# EAGLE design usbcpd (EAGLE 9.2.2)
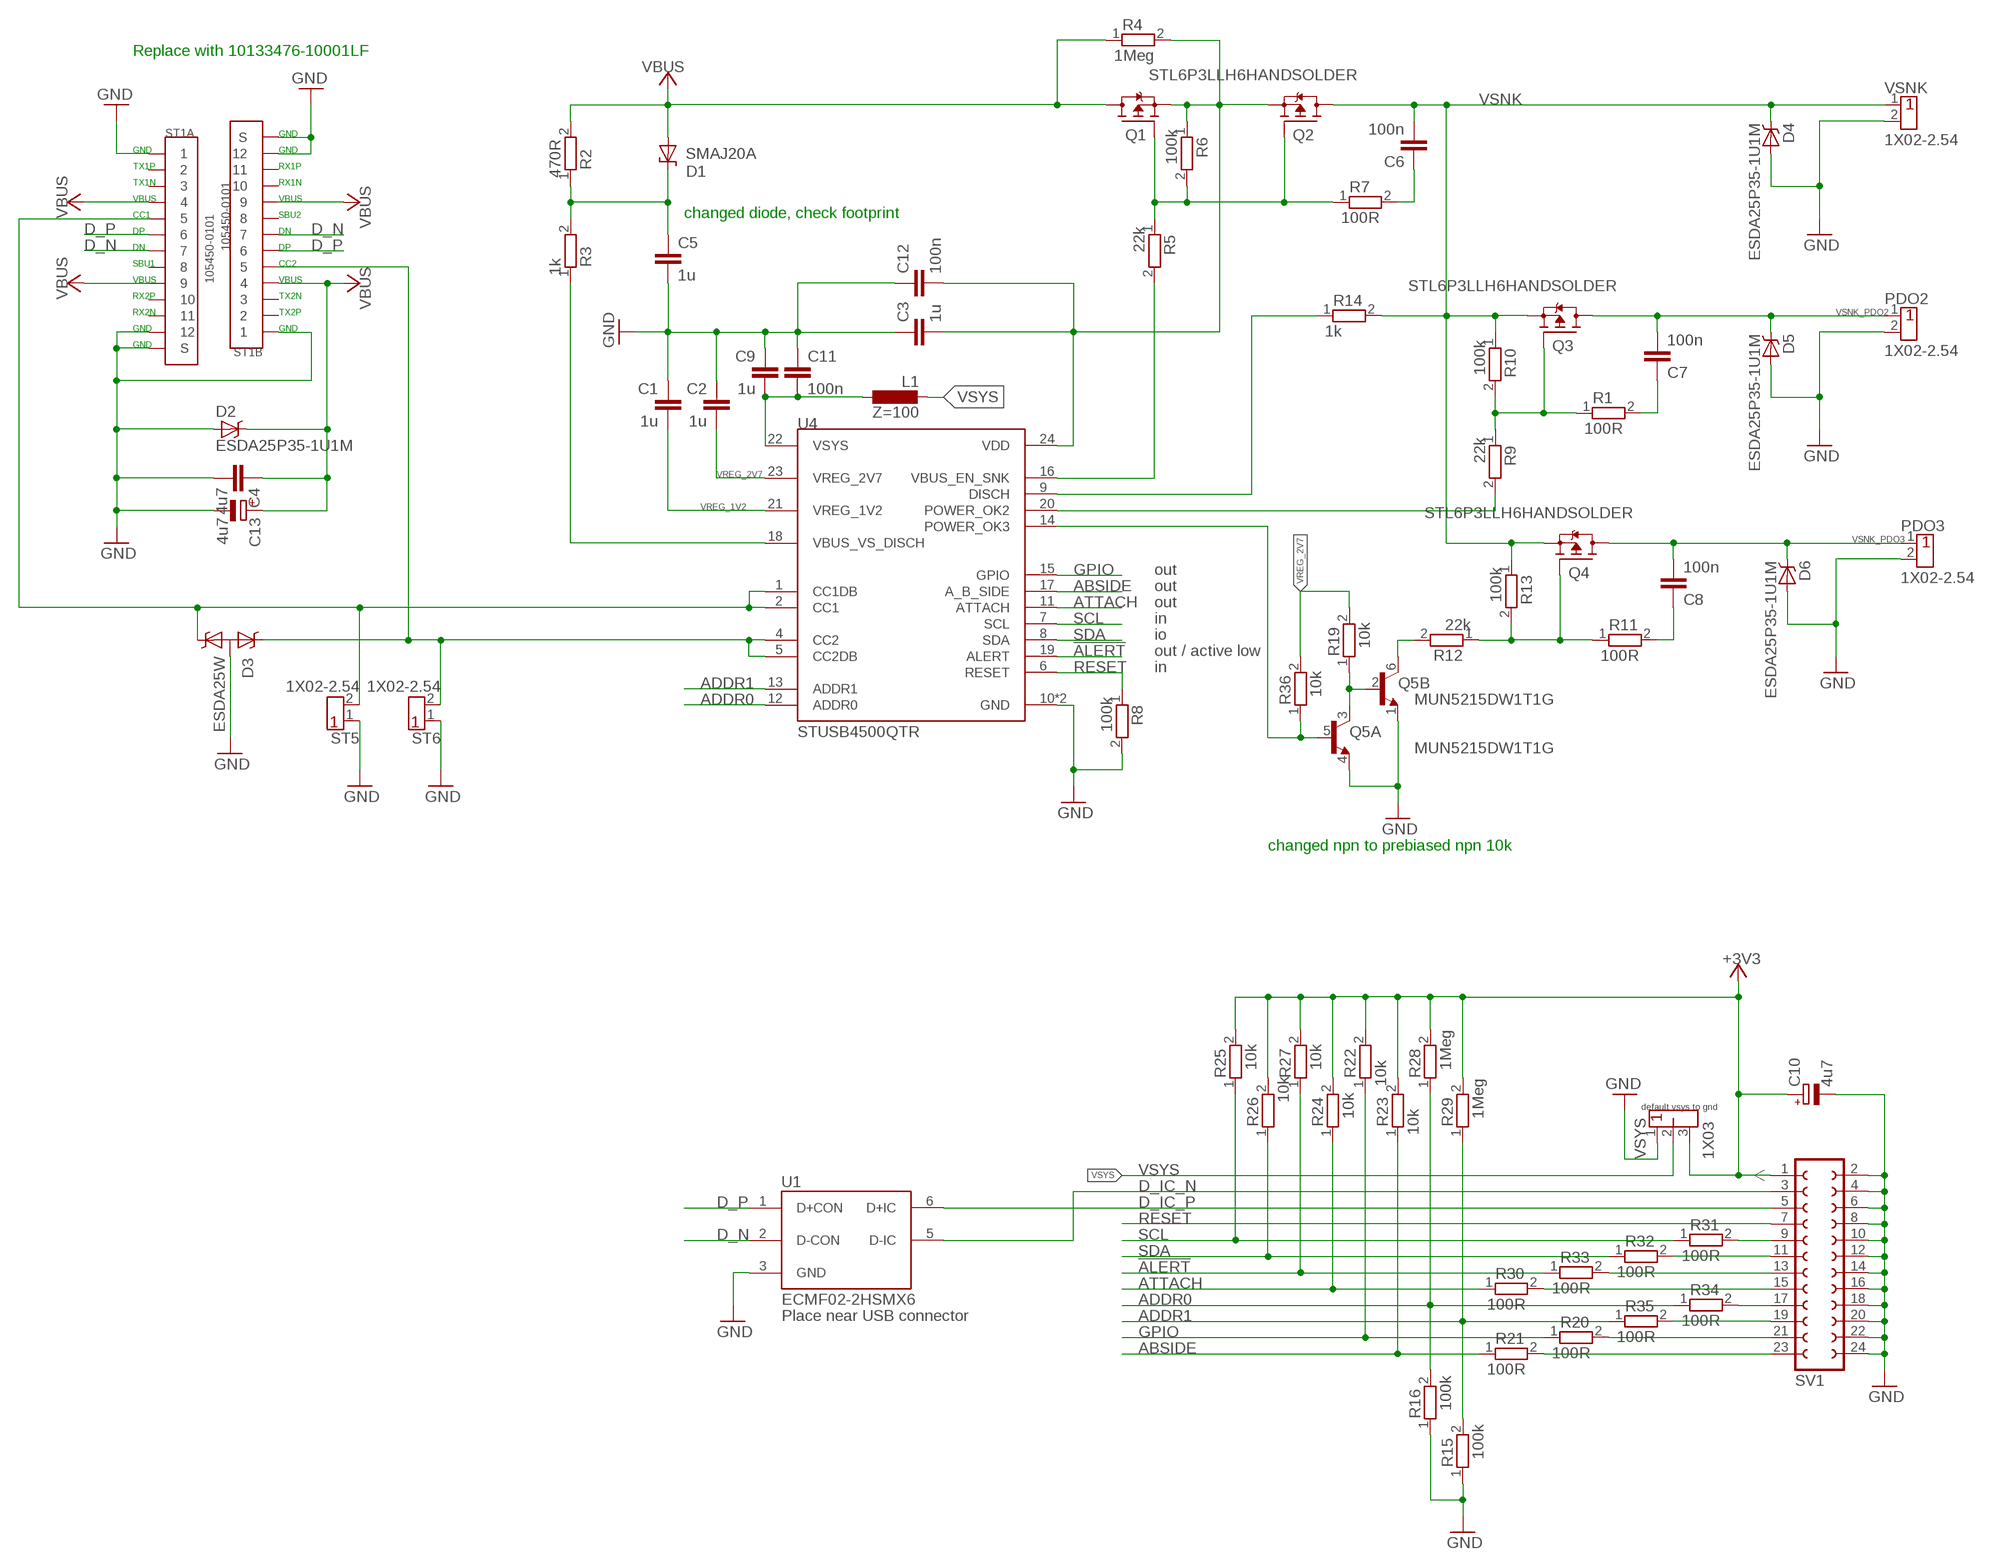
[diagram p0: schematic, sheet 1]

## Parts
C1  1u  C-EU0805  [0805]
C2  1u  C-EU0805  [0805]
C3  1u  C-EU0805  [0805]
C4  4u7  C-EU0805  [0805]
C5  1u  C-EU0805  [0805]
C6  100n  C-EU0805  [0805]
C7  100n  C-EU0805  [0805]
C8  100n  C-EU0805  [0805]
C9  1u  C-EU0805  [0805]
C10  4u7  CPOL-EUE2-5  [E2-5]
C11  100n  C-EU0805  [0805]
C12  100n  C-EU0805  [0805]
C13  4u7  CPOL-EUE2-5  [E2-5]
D1  SMAJ20A  SMBJ28A  [SMBJ]
D2  ESDA25P35-1U1M  [QFN1610]
D3  ESDA25W  [SOT323-3]
D4  ESDA25P35-1U1M  [QFN1610]
D5  ESDA25P35-1U1M  [QFN1610]
D6  ESDA25P35-1U1M  [QFN1610]
L1  Z=100  L-EU0805  [0805]
PDO2  1X02-2.54  [1X02-2.54]
PDO3  1X02-2.54  [1X02-2.54]
Q1  STL6P3LLH6HANDSOLDER  [POWERFLAT-TYPEC-HANDSOLDER]
Q2  STL6P3LLH6HANDSOLDER  [POWERFLAT-TYPEC-HANDSOLDER]
Q3  STL6P3LLH6HANDSOLDER  [POWERFLAT-TYPEC-HANDSOLDER]
Q4  STL6P3LLH6HANDSOLDER  [POWERFLAT-TYPEC-HANDSOLDER]
Q5  MUN5215DW1T1G  BC847CDW1  [SOT363]
R1  100R  R-EU0805  [0805]
R2  470R  R-EU0805  [0805]
R3  1k  R-EU0805  [0805]
R4  1Meg  R-EU0805  [0805]
R5  22k  R-EU0805  [0805]
R6  100k  R-EU0805  [0805]
R7  100R  R-EU0805  [0805]
R8  100k  R-EU0805  [0805]
R9  22k  R-EU0805  [0805]
R10  100k  R-EU0805  [0805]
R11  100R  R-EU0805  [0805]
R12  22k  R-EU0805  [0805]
R13  100k  R-EU0805  [0805]
R14  1k  R-EU0805  [0805]
R15  100k  R-EU0805  [0805]
R16  100k  R-EU0805  [0805]
R19  10k  R-EU0805  [0805]
R20  100R  R-EU0805  [0805]
R21  100R  R-EU0805  [0805]
R22  10k  R-EU0805  [0805]
R23  10k  R-EU0805  [0805]
R24  10k  R-EU0805  [0805]
R25  10k  R-EU0805  [0805]
R26  10k  R-EU0805  [0805]
R27  10k  R-EU0805  [0805]
R28  1Meg  R-EU0805  [0805]
R29  1Meg  R-EU0805  [0805]
R30  100R  R-EU0805  [0805]
R31  100R  R-EU0805  [0805]
R32  100R  R-EU0805  [0805]
R33  100R  R-EU0805  [0805]
R34  100R  R-EU0805  [0805]
R35  100R  R-EU0805  [0805]
R36  10k  R-EU0805  [0805]
ST1  105450-0101  [105450-0101]
ST5  1X02-2.54  [1X02-2.54]
ST6  1X02-2.54  [1X02-2.54]
SV1  FE12-2  [FE12-2]
U1  ECMF02-2HSMX6  [UQFN6]
U4  STUSB4500QTR  [QFN24EP]
VSNK  1X02-2.54  [1X02-2.54]
VSYS  1X03  [1X03-2.54]

## Nets
!ALERT: R27.1 R33.1 U4.19(ALERT)
+3V3: C10.+ R22.2 R23.2 R24.2 R25.2 R26.2 R27.2 R28.2 R29.2 SV1.1 VSYS.3
ABSIDE: R21.1 R23.1 U4.17(A_B_SIDE)
ADDR0: R16.2 R28.1 R34.1 U4.12(ADDR0)
ADDR1: R15.2 R29.1 R35.1 U4.13(ADDR1)
ATTACH: R24.1 R30.1 U4.11(ATTACH)
CC1: D3.2(C2) ST1.A5 ST5.2 U4.1(CC1DB) U4.2(CC1)
CC2: D3.1(C1) ST1.B5 ST6.2 U4.4(CC2) U4.5(CC2DB)
D_IC_N [lvds]: SV1.3 U1.5(D-IC)
D_IC_P [lvds]: SV1.5 U1.6(D+IC)
D_N [lvds]: ST1.A7 ST1.B7 U1.2(D-CON)
D_P [lvds]: ST1.A6 ST1.B6 U1.1(D+CON)
DISCH: R14.1 U4.9(DISCH)
GND: C1.1 C2.1 C3.1 C4.2 C5.2 C9.1 C10.- C11.1 C12.1 C13.- D2.2(A) D3.3(A) D4.2(A) D5.2(A) D6.2(A) PDO2.2 PDO3.2 Q5.1(B:E) Q5.4(A:E) R8.2 R15.1 R16.1 ST1.A1 ST1.A12 ST1.B1 ST1.B12 ST1.G1(A:S) ST1.G2(A:S) ST1.G3(A:S) ST1.G4(A:S) ST1.G5(B:S) ST1.G6(B:S) ST1.G7(A:S) ST1.G8(B:S) ST1.G9(A:S) ST1.G10(A:S) ST1.G11(A:S) ST1.G12(A:S) ST1.G13(A:S) ST1.G14(A:S) ST1.G15(A:S) ST1.G16(A:S) ST1.G17(A:S) ST1.G18(A:S) ST1.G19(A:S) ST1.G20(B:S) ST1.G21(B:S) ST1.G22(B:S) ST1.G23(B:S) ST1.G24(B:S) ST1.G25(B:S) ST1.G26(B:S) ST1.G27(B:S) ST1.G28(B:S) ST1.G29(B:S) ST1.G30(B:S) ST1.G31(B:S) ST1.G32(B:S) ST1.G33(B:S) ST5.1 ST6.1 SV1.2 SV1.4 SV1.6 SV1.8 SV1.10 SV1.12 SV1.14 SV1.16 SV1.18 SV1.20 SV1.22 SV1.24 U1.3(GND) U4.10(GND) U4.TP(GND) VSNK.2 VSYS.1
GPIO: R20.1 R22.1 U4.15(GPIO)
N$1: C5.1 D1.C R2.1 R3.2
N$7: Q1.4(G) Q2.4(G) R5.1 R6.2 R7.1
N$10: C6.1 R7.2
N$13: C7.1 R1.2
N$14: Q3.4(G) R1.1 R9.1 R10.2
N$15: C8.1 R11.2
N$16: Q4.4(G) R11.1 R12.1 R13.2
N$19: R20.2 SV1.21
N$20: R21.2 SV1.23
N$21: R31.2 SV1.9
N$22: R30.2 SV1.15
N$23: R33.2 SV1.13
N$24: R32.2 SV1.11
N$25: R34.2 SV1.17
N$26: R35.2 SV1.19
N$27: C9.2 C11.2 L1.1 U4.22(VSYS)
N$28: Q5.2(B:B) Q5.3(A:C) R19.1
N$29: Q5.6(B:C) R12.2
PDO2: R9.2 U4.20(POWER_OK2)
PDO3: Q5.5(A:B) R36.1 U4.14(POWER_OK3)
RESET: R8.1 SV1.7 U4.6(RESET)
SCL: R25.1 R31.1 U4.7(SCL)
SDA: R26.1 R32.1 U4.8(SDA)
VBUS: C4.1 C13.+ D1.A D2.1(C) Q1.5(D) R2.2 R4.1 ST1.A4 ST1.A9 ST1.B4 ST1.B9
VBUS_EN_SNK: R5.2 U4.16(VBUS_EN_SNK)
VBUS_VS_DISCH: R3.1 U4.18(VBUS_VS_DISCH)
VDD: C3.2 C12.2 Q1.1(S) Q1.2(S) Q1.3(S) Q2.1(S) Q2.2(S) Q2.3(S) R4.2 R6.1 U4.24(VDD)
VREG_1V2: C1.2 U4.21(VREG_1V2)
VREG_2V7: C2.2 R19.2 R36.2 U4.23(VREG_2V7)
VSNK: C6.2 D4.1(C) Q2.5(D) Q3.1(S) Q3.2(S) Q3.3(S) Q4.1(S) Q4.2(S) Q4.3(S) R10.1 R13.1 R14.2 VSNK.1
VSNK_PDO2: C7.2 D5.1(C) PDO2.1 Q3.5(D)
VSNK_PDO3: C8.2 D6.1(C) PDO3.1 Q4.5(D)
VSYS: L1.2 VSYS.2
Unconnected: ST1.A2 ST1.A3 ST1.A8 ST1.A10 ST1.A11 ST1.B2 ST1.B3 ST1.B8 ST1.B10 ST1.B11

## Notes on the sheet
- Replace with 10133476-10001LF
- GND
- GND | GND
- TX1P | RX1P
- TX1N | RX1N
- VBUS | VBUS
- CC1 | SBU2 | changed diode, check footprint
- DP | DN
- DN | DP
- SBU1 | CC2
- VBUS | VBUS
- RX2P | TX2N
- RX2N | TX2P
- GND | GND
- GND
- out
- out
- out
- in
- io
- out / active low
- in
- changed npn to prebiased npn 10k
- default vsys to gnd
- Place near USB connector

## Library data of the parts
C1-C9 C11 C12 = rcl-Conti:C-EU
C10 C13 = rcl:CPOL-EU: POLARIZED CAPACITOR, European symbol; SPICEPREFIX: C
D1 = diodes-conti:SMBJ28A: SMBJ Datasheet http://www.farnell.com/datasheets/1761316.pdf; MF: Bourns; MPN: SMAJ20A; OC_MOUSER: 652-SMAJ20A
D2 D4-D6 = stm_ESDA25:ESDA25P35: ESDA25P35 High power transient voltage suppressor Datasheet https://www.st.com/resource/en/datasheet/esda25p35-1u1m.pdf; MF: ST MICROELECTRONICS; MPN: ESDA25P35-1U1M; OC_MOUSER: 511-ESDA25P35-1U1M
D3 = stm_ESDA25:ESDA25W: ESDAxxxWx TRANSIL™ array for data protection Datasheet https://www.st.com/resource/en/datasheet/esdaxxxwx.pdf; MF: ST MICROELECTRONICS; MPN: ESDA25W
L1 = rcl-Conti:L-EU; MF: TDK; MPN: MPZ2012S101AT000; OC_MOUSER: 810-MPZ2012S101AT000
PDO2 PDO3 ST5 ST6 VSNK = Stecker:1X02-2.54
Q1-Q4 = stm_STL6P3LLH6:STL6P3LLH6: STL6P3LLH6 P-channel 30 V, 0.024 Ω typ., 6 A STripFET™ H6 Datasheet https://www.st.com/resource/en/datasheet/stl6p3llh6.pdf; MF: ST MICROELECTRONICS; MPN: STL6P3LLH6; OC_MOUSER: 511-STL6P3LLH6
Q5 = Transistoren:BC847: BC846BDW1, BC847BDW1, BC848CDW1 Dual General Purpose Transistors NPN Duals Datasheet http://www.farnell.com/datasheets/2118315.pdf; MF: ON SEMICONDUCTOR; MPN: MUN5215DW1T1G; OC_MOUSER: 863-MUN5215DW1T1G
R1-R16 R19-R36 = rcl-Conti:R-EU
ST1 = moldex_USBTypeC-105450-0101:105450-0101: Universal Serial Bus (USB) Shielded I/O Receptacle, Type C, Right-Angle, Top Mount, Surface Mount, Gold (Au) Flash over 0.76µm Palladium Nickel Plating Datasheet https://www.molex.com/pdm_docs/sd/1054500101_sd.pdf; MF: Molex; MPN: 105450-0101; OC_MOUSER: 538-105450-0101
SV1 = con-lsta:FE12-2: FEMALE HEADER; OC_FARNELL: unknown; OC_NEWARK: unknown
U1 = stm_ecmf02:ECMF02-2HSMX6: ECMF02-2HSMX6 ESD protected common mode filter for USB3.0 interface Datasheet https://www.st.com/resource/en/datasheet/ecmf02-2hsmx6.pdf; MF: STMicroelectronics; MPN: ECMF02-2HSMX6; OC_MOUSER: 511-ECMF02-2HSMX6
U4 = stm_stusb4500:STUSB4500: Standalone USB PD sink controller with short-to-VBUS protections Datasheet https://www.st.com/resource/en/datasheet/stusb4500.pdf; MF: ST MICROELECTRONICS; MPN: STUSB4500QTR; OC_MOUSER: 511-STUSB4500QTR; SPICEPREFIX: X
VSYS = Stecker:1X03; MF: MULTICOMP; MPN: 2211S-03G; OC_FARNELL: 1593412

## Net classes
0 default: width 0.152 mm, drill 0.3 mm, clearance 0.152 mm
1 lvds: width 0.305 mm, drill 0.3 mm, clearance 0.127 mm to class 0, clearance 0.152 mm

## Board
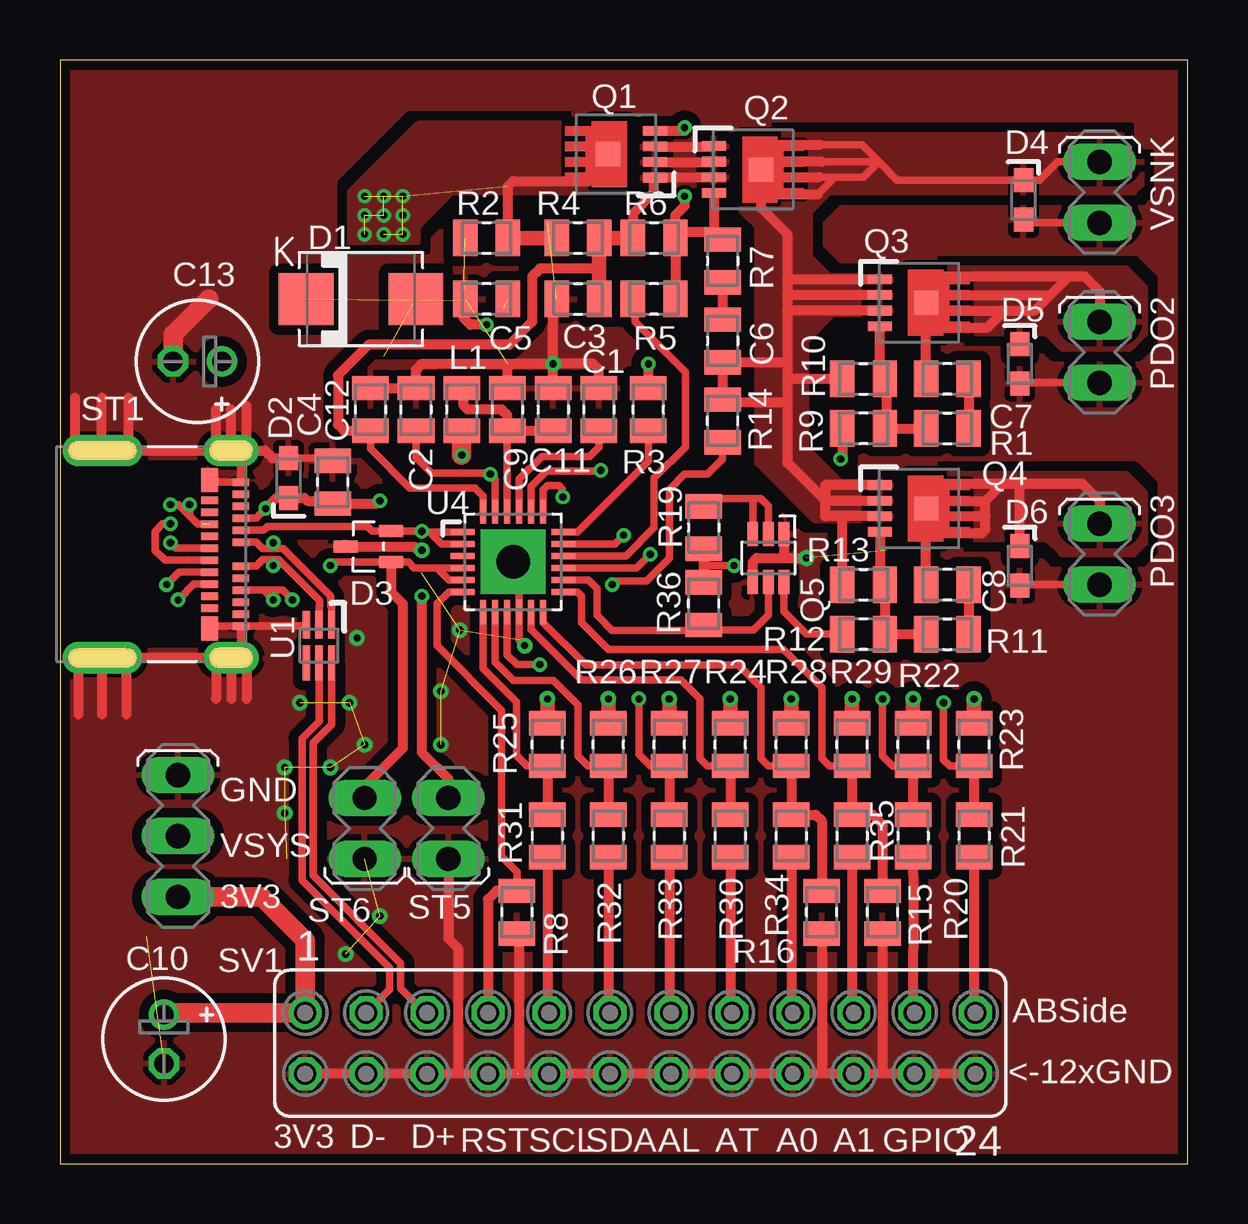
[diagram p1: board, top side]
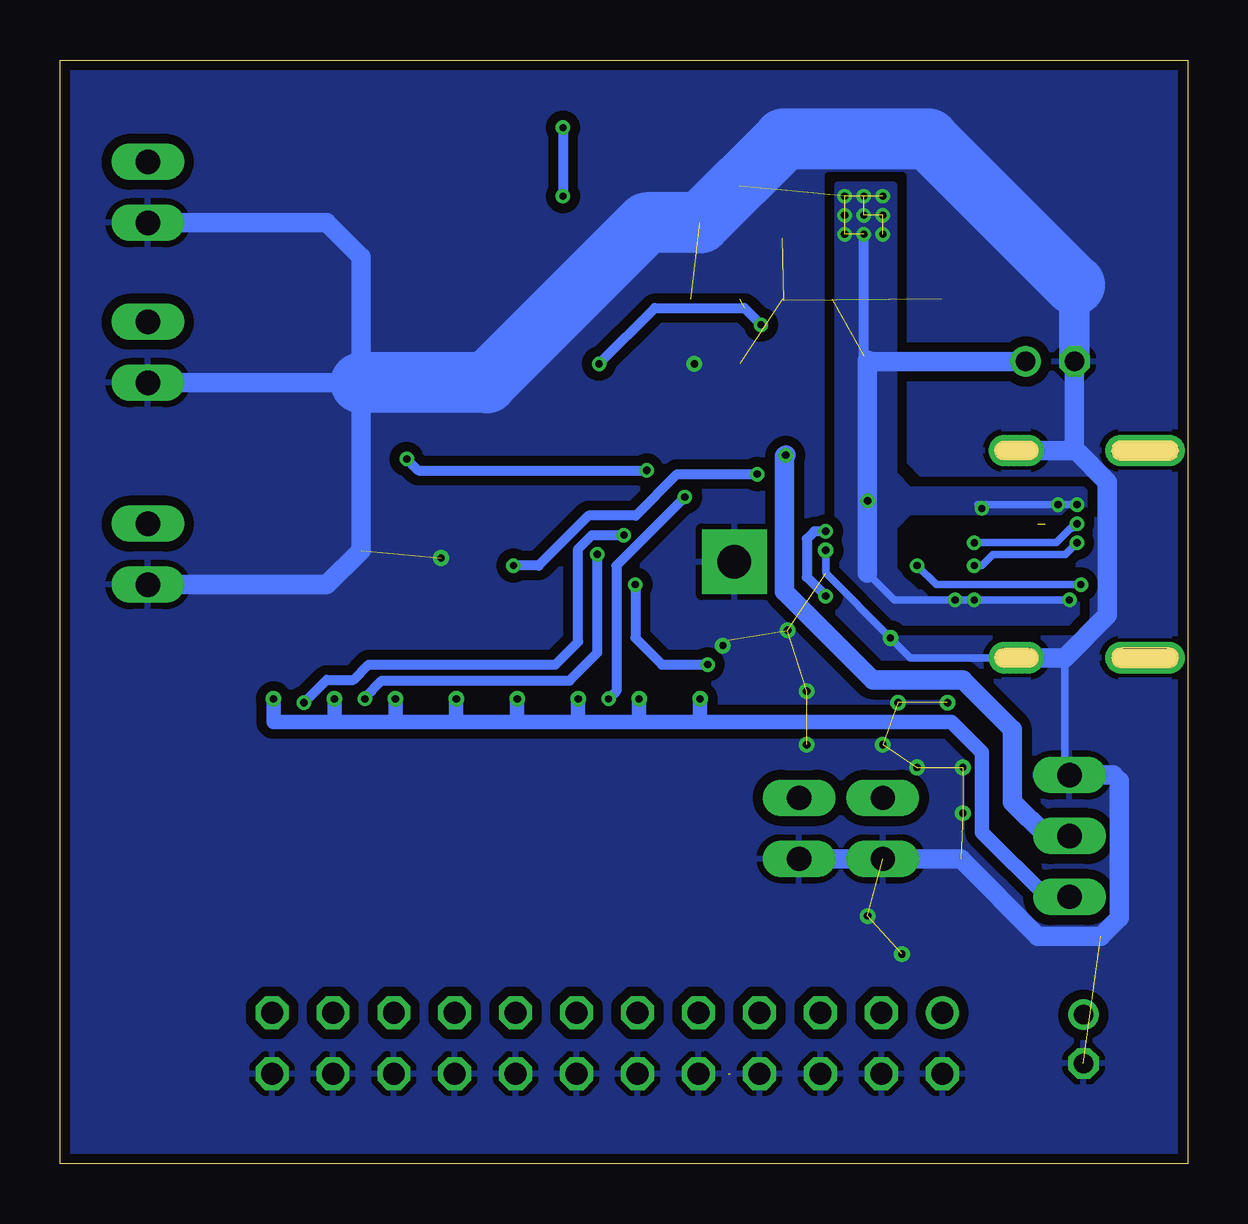
[diagram p2: board, bottom side, seen from below]

Size 47 x 46 mm. Coordinates in mm from the lower left corner, seen from the top.
Outline: 0,0 47,0 47,46 0,46 0,0
Copper layers (1*16): Top 0.035mm / dielectric 1.5mm / Bottom 0.035mm
Design rules "jlcpcb *": minimum track width 5mil, minimum drill 0.3mm, track to track 5mil, track to pad 5mil, pad to pad 5mil, via to via 5mil, smd to smd 5mil, copper to edge 0.2mm, drill to drill 6mil, minimum pad ring 0.15mm, minimum via ring 0.15mm, stop-mask expansion 4mil, vias tented up to drill 0mil, thermal gap 10mil

### Footprints (pad centres in the part's own frame; a part is rotated, then mirrored left to right if it is on the bottom)
0805 = smd 1.016 x 1.524: 1 -0.889,0; 2 0.889,0
E2-5 = drill 0.813 pad 1.27: + -1.016,0 | drill 0.813 pad 1.27 octagon: - 1.016,0
SMBJ = smd 2.28 x 2.16: A 2.29,0; C -2.28,0
QFN1610 = smd 1 x 0.8: 1 -0.825,0; 2 0.825,0
SOT323-3 = smd 0.5 x 1: 1 -0.65,-0.95; 2 0.65,-0.95; 3 0,0.95
1X02-2.54 = drill 1.016 long: 1 -1.27,0; 2 1.27,0
POWERFLAT-TYPEC-HANDSOLDER = smd 0.4 x 1: 1 -0.975,-1.625; 2 -0.325,-1.625; 3 0.325,-1.625; 4 0.975,-1.625 | smd 1 x 1: 5 0,0.325
SOT363 = smd 1 x 0.45: 1 -1,0.65; 2 -1,0; 3 -1,-0.65; 4 1,-0.65; 5 1,0; 6 1,0.65
105450-0101 = smd 0.3 x 0.7: A1 -3,7.54; A2 -2.5,7.54; A3 -2,7.54; A4 -1.5,7.54; A5 -1,7.54; A6 -0.5,7.54; A7 0.5,7.54; A8 1,7.54; A9 1.5,7.54; A10 2,7.54; A11 2.5,7.54; A12 3,7.54; B2 2.25,6.24; B3 1.75,6.24; B4 1.25,6.24; B5 0.75,6.24; B6 0.25,6.24; B7 -0.25,6.24; B8 -0.75,6.24; B9 -1.25,6.24; B10 -1.75,6.24; B11 -2.25,6.24 | smd 1 x 0.7: B1 3.1,6.24; B12 -3.1,6.24 | drill 0.8 pad 1.3: G1 -4.32,7.13; G2 -4.32,0.77; G3 -4.32,7.63; G4 -4.32,2.77; G5 4.32,7.13; G6 4.32,0.77; G7 -4.32,6.63; G8 4.32,2.77; G9 -4.32,2.57; G10 -4.32,2.37; G11 -4.32,2.17; G12 -4.32,2.17; G13 -4.32,1.77; G14 -4.32,1.57; G15 -4.32,1.37; G16 -4.32,1.17; G17 -4.32,0.97; G18 -4.32,7.38; G19 -4.32,6.88; G20 4.32,7.38; G21 4.32,7.63; G22 4.32,6.88; G23 4.32,6.63; G24 4.32,2.57; G25 4.32,2.37; G26 4.32,2.17; G27 4.32,1.97; G28 4.32,1.77; G29 4.32,1.57; G30 4.32,1.37; G31 4.32,1.17; G32 4.32,0.97; G33 -4.32,1.97
FE12-2 = drill 0.914: 1 -13.97,1.27 | drill 0.914 octagon: 2 -13.97,-1.27; 3 -11.43,1.27; 4 -11.43,-1.27; 5 -8.89,1.27; 6 -8.89,-1.27; 7 -6.35,1.27; 8 -6.35,-1.27; 9 -3.81,1.27; 10 -3.81,-1.27; 11 -1.27,1.27; 12 -1.27,-1.27; 13 1.27,1.27; 14 1.27,-1.27; 15 3.81,1.27; 16 3.81,-1.27; 17 6.35,1.27; 18 6.35,-1.27; 19 8.89,1.27; 20 8.89,-1.27; 21 11.43,1.27; 22 11.43,-1.27; 23 13.97,1.27; 24 13.97,-1.27
UQFN6 = smd 0.3 x 1.15: 1 -0.525,-0.875; 2 0,-0.875; 3 0.525,-0.875 | smd 0.3 x 1.45: 4 0.525,0.725; 5 0,0.725; 6 -0.525,0.725
QFN24EP = smd 1 x 0.25: 1 -2.1,1.25; 2 -2.1,0.75; 3 -2.1,0.25; 4 -2.1,-0.25; 5 -2.1,-0.75; 6 -2.1,-1.25; 13 2.1,-1.25; 14 2.1,-0.75; 15 2.1,-0.25; 16 2.1,0.25; 17 2.1,0.75; 18 2.1,1.25 | smd 0.25 x 1: 7 -1.25,-2.1; 8 -0.75,-2.1; 9 -0.25,-2.1; 10 0.25,-2.1; 11 0.75,-2.1; 12 1.25,-2.1; 19 1.25,2.1; 20 0.75,2.1; 21 0.25,2.1; 22 -0.25,2.1; 23 -0.75,2.1; 24 -1.25,2.1 | drill 1.4 pad 2.7 square: TP 0,0
1X03-2.54 = drill 1.016 long: 1 -2.54,0; 2 0,0; 3 2.54,0

### Placement (x,y rotation side)
C1  22.46,31.43 270 top
C2  14.84,31.43 270 top
C3  21.59,36.04 0 top
C4  11.37,28.4 90 top
C5  17.78,36.04 180 top
C6  27.62,34.29 270 top
C7  36.99,32.7 180 top
C8  36.99,24.13 180 top
C9  18.65,31.43 270 top
C10  4.33,5.19 270 top
C11  20.56,31.43 270 top
C12  12.94,31.43 270 top
C13  5.73,33.43 180 top
D1  12.54,36.04 0 top
D2  9.53,28.57 90 top
D3  12.86,25.72 90 top
D4  40.16,40.16 270 top
D5  40.01,33.34 270 top
D6  40.01,24.92 270 top
L1  16.75,31.43 270 top
PDO2  43.34,33.81 270 top
PDO3  43.34,25.4 270 top
Q1  23.18,42.07 90 top
Q2  28.89,41.43 270 top
Q3  35.8,35.88 270 top
Q4  35.8,27.3 270 top
Q5  29.53,25.24 270 top
R1  36.99,30.64 0 top
R2  17.78,38.58 0 top
R3  24.53,31.43 90 top
R4  21.59,38.58 0 top
R5  24.77,36.04 180 top
R6  24.77,38.58 0 top
R7  27.62,37.62 270 top
R8  19.05,10.48 270 top
R9  33.5,30.64 180 top
R10  33.5,32.7 0 top
R11  36.99,22.07 0 top
R12  33.5,22.07 180 top
R13  33.5,24.13 0 top
R14  27.62,30.96 90 top
R15  34.29,10.48 90 top
R16  31.75,10.48 90 top
R19  26.83,26.51 270 top
R20  35.56,13.65 270 top
R21  38.1,13.65 270 top
R22  35.56,17.46 90 top
R23  38.1,17.46 90 top
R24  27.94,17.46 90 top
R25  20.32,17.46 90 top
R26  22.86,17.46 90 top
R27  25.4,17.46 90 top
R28  30.48,17.46 90 top
R29  33.02,17.46 90 top
R30  27.94,13.65 270 top
R31  20.32,13.65 270 top
R32  22.86,13.65 270 top
R33  25.4,13.65 270 top
R34  30.48,13.65 270 top
R35  33.02,13.65 270 top
R36  26.83,23.34 90 top
ST1  0,25.4 270 top
ST5  16.19,13.97 90 top
ST6  12.7,13.97 90 top
SV1  24.19,5.02 0 top
U1  10.79,21.59 180 top
U4  18.89,25.08 0 top
VSNK  43.34,40.48 270 top
VSYS  4.92,13.65 270 top

### Tracks (layer width: path | path; a pad name or v marks a point on that pad's centre or on a via)
!ALERT  (via drill 0.3)
  Top 0.305: v20.95,27.78 20.95,28.1 20.8,28.26 20.32,28.26 20.14,28.08 U4.19 | v24.13,19.37 24.13,17.05 24.61,16.57 R27.1
  Top 0.406: R27.1 R33.1
  Bottom 0.406: v20.95,27.78 23.81,24.92 23.81,19.68 v24.13,19.37
+3V3  (via drill 0.3 pad 0.65)
  Top 0.61: R26.2 v22.86,19.37 | R27.2 v25.4,19.37 | R24.2 v27.94,19.37 | R28.2 v30.48,19.37 | R29.2 v33.02,19.37 | v35.56,19.37 R22.2 | R23.2 v38.1,19.37 | R25.2 v20.32,19.37
  Top 0.813: VSYS.3 8.41,11.11 10.22,9.3 SV1.1 4.41,6.29 C10.+
  Bottom 0.61: 5.87,11.11 8.57,13.81 8.57,17.14 9.84,18.41 20.32,18.41 | 20.32,18.41 22.86,18.41 | 22.86,18.41 25.4,18.41 | 25.4,18.41 27.94,18.41 | 27.94,18.41 30.48,18.41 | 30.48,18.41 33.02,18.41 | 33.02,18.41 35.56,18.41 | 35.56,18.41 38.1,18.41 v38.1,19.37 | v35.56,19.37 35.56,18.41 | v33.02,19.37 33.02,18.41 | v30.48,19.37 30.48,18.41 | v27.94,19.37 27.94,18.41 | v25.4,19.37 25.4,18.41 | v22.86,19.37 22.86,18.41 | v20.32,19.37 20.32,18.41
  Bottom 0.813: VSYS.3 5.87,11.11
ABSIDE  (via drill 0.3)
  Top 0.305: v23.5,26.19 23.13,25.83 U4.17 | v36.83,19.21 36.83,16.83 37.08,16.57 R23.1
  Top 0.406: R23.1 R21.1
  Bottom 0.406: v36.83,19.21 35.88,20.16 34.77,20.16 34.13,20.8 26.35,20.8 25.4,21.75 25.4,25.62 24.83,26.19 v23.5,26.19
ADDR0
  Top 0.305: U4.12 20.14,22.56 21.93,20.78 28.28,20.78 29.21,19.84 29.21,16.89 29.53,16.57 R28.1
  Top 0.406: R28.1 R34.1 31.5,14.54 31.75,14.29 R16.2
ADDR1
  Top 0.305: R29.1 32.07,16.57 31.75,16.89 31.75,19.84 30.16,21.43 22.86,21.43 21.75,22.54 21.75,23.65 21.57,23.83 U4.13
  Top 0.406: R29.1 R35.1 33.88,14.54 34.29,14.13 R15.2
ATTACH
  Top 0.305: R24.1 26.99,16.57 26.67,16.89 26.67,19.37 25.88,20.16 21.75,20.16 19.64,22.27 U4.11
  Top 0.406: R24.1 R30.1
CC1  (via drill 0.3)
  Top 0.305: U4.2 15.9,25.83 15.4,26.33 | U4.1 15.4,26.33 | 15.4,26.33 15.1,26.33 v15.08,26.35 15.07,26.37 D3.2 13.02,26.37 12.83,26.56 8.65,26.56 8.49,26.4 ST1.A5
  Top 0.406: v15.08,23.65 15.08,17.14 16.19,16.03 ST5.2
  Bottom 0.406: v15.08,26.35 15.56,26.35 15.88,26.04 15.88,24.45 v15.08,23.65
CC2  (via drill 0.3)
  Top 0.305: ST1.B5 4.96,24.65 v4.45,24.13 | v11.27,24.92 11.41,25.07 D3.1 14.53,25.07 14.76,24.83 15.72,24.83 | U4.4 15.72,24.83 | U4.5 16.22,24.33 15.72,24.83
  Top 0.406: D3.1 13.81,23.82 14.29,23.34 14.29,17.3 12.7,15.72 ST6.2
  Bottom 0.305: v4.45,24.13 10.48,24.13 v11.27,24.92
D_IC_N
  Top 0.305: U1.5 10.79,18.42 10.09,17.72 10.09,11.81 13.74,8.16 13.74,7.26 SV1.3
D_IC_P
  Top 0.305: U1.6 11.32,18.3 10.55,17.53 10.55,12 14.2,8.35 14.2,7.3 15.21,6.29 SV1.5
D_N  (via drill 0.3)
  Top 0.305: ST1.A7 8.18,24.9 8.45,25.17 8.89,25.17 | 8.89,25.17 9.11,25.17 10.82,23.46 10.82,23.24 10.79,23.22 U1.2 | ST1.B7 4.83,25.65 v4.6,25.88 | v8.89,24.92 8.89,25.17
  Bottom 0.305: v4.6,25.88 5.1,25.38 8.12,25.38 8.57,24.92 v8.89,24.92
D_P  (via drill 0.3)
  Top 0.305: ST1.A6 8.18,25.9 8.45,25.63 8.89,25.63 | 8.89,25.63 9.3,25.63 11.28,23.65 11.28,23.24 11.32,23.2 U1.1 | v8.89,25.88 8.89,25.63 | v4.6,26.67 4.29,26.67 3.97,26.35 3.97,25.56 4.38,25.15 ST1.B6
  Bottom 0.305: v8.89,25.88 5.46,25.88 4.85,26.48 4.79,26.48 v4.6,26.67
DISCH  (via drill 0.3)
  Top 0.305: v20,20.8 19.05,20.8 18.64,21.2 U4.9 | v23.02,24.13 23.18,24.29 24.45,24.29 25.4,25.24 25.4,28.1 26.04,28.73 26.99,28.73 27.62,29.37 R14.1
  Bottom 0.406: v23.02,24.13 23.02,21.91 21.91,20.8 v20,20.8
GND  (via drill 0.3 pad 0.65)  (33 unrouted)
  Top 0.305: ST1.A12 7.54,21.33 7.29,21.08 | ST1.B1 6.34,22.4 ST1.A12 | D2.2 11.26,29.4 C4.2 | D4.2 40.29,39.21 VSNK.2 | D5.2 40.04,32.54 PDO2.2 | PDO3.2 40.04,24.13 D6.2 | v19.37,21.59 19.14,21.82 U4.10 19.14,24.83 U4.TP | U1.3 10.21,22.4 ST1.A12 | ST1.B12 6.34,28.4 ST1.A1 7.54,29.63
  Top 0.406: D3.3 14.76,25.72 14.92,25.56 v15.08,25.56 | C12.1 C2.1 14.84,33.1 15.08,33.34 18.65,33.34 | C11.1 v20.56,33.34 | C9.1 18.65,33.34 | Q5.4 28.88,25.07 29.05,25.24 30.16,25.24 | 30.16,25.24 v31.11,25.24 | Q5.1 30.18,25.26 30.16,25.24 | 7.29,21.08 ST1.G8 | SV1.24 SV1.22 34.29,3.75 | 34.29,3.75 SV1.20 31.75,3.75 | 31.75,3.75 SV1.18 SV1.16 SV1.14 SV1.12 SV1.10 19.13,3.75 19.13,9.51 R8.2 | 19.05,3.75 SV1.8 16.59,3.75 | 16.59,3.75 SV1.6 SV1.4 SV1.2 | R15.1 34.29,3.75 | R16.1 31.75,3.75 | ST5.1 16.19,9.37 16.59,8.97 16.59,3.75 | 18.65,33.34 v20.56,33.34 | v20.56,33.34 20.56,35.89 C3.1 | C1.1 22.46,33.1 22.23,33.34 v20.56,33.34 | ST1.G23 ST1.G21 | D2.2 8.86,29.4 8.54,29.72 ST1.G3 | ST1.G13 ST1.G12 | ST1.G9 ST1.G4 ST1.G7 ST1.G18 | ST1.G19 ST1.G1 7.13,31.43 | ST1.G3 ST1.G18 | ST1.G8 ST1.G24 ST1.G6 0.77,18.73 | ST1.G2 ST1.G17 ST1.G13 | ST1.G2 ST1.G16 1.75,29.72 1.75,31.91 | ST1.G2 ST1.G15 ST1.G12 | ST1.G13 ST1.G33 ST1.G12 | ST1.G12 ST1.G10 2.86,29.72 2.86,31.91 | ST1.G18 6.51,29.72 6.51,31.43 | ST1.G3 7.78,29.72 7.78,31.59 | ST1.G2 0.64,29.72 0.64,31.91 | ST1.G31 1.75,21.08 1.75,18.73 | ST1.G8 2.77,18.73 | ST1.G23 6.67,21.08 | ST1.G23 7.3,21.08 | ST1.G23 6.51,21.08 6.51,19.37 | ST1.G23 7.14,21.08 7.14,19.37 | ST1.G5 7.78,21.08 7.78,19.37
  Top 0.813: C13.- 4.71,34.56 6.19,36.04
  Bottom 0.305: v15.08,25.56 15.08,24.61 v12.38,21.91 11.55,21.08 ST1.G5 | VSYS.1 5.11,16.39 5.11,21.08
  Bottom 0.813: VSYS.1 3.08,16.19 2.84,15.95 2.84,10.25 3.61,9.47 6.23,9.47 9.46,12.7 ST6.1 ST5.1 | ST1.G5 5.11,21.08 3.33,22.86 3.33,28.42 4.64,29.72 | 4.64,29.72 ST1.G1 | 4.64,29.72 4.71,29.8 C13.- | 34.45,32.54 PDO2.2 | VSNK.2 35.88,39.21 34.45,37.78 34.45,32.54 | PDO3.2 35.88,24.13 34.45,25.56 34.45,32.54
  Bottom 1.27: C13.- 4.71,36.62
  Bottom 2.54: 4.71,36.62 10.79,42.7 16.83,42.7 20.32,39.21 22.54,39.21 29.21,32.54 34.45,32.54
  other vias: 12.7,17.46 15.88,17.46 12.06,19.21 9.37,16.51 9.37,14.61 11.27,16.51 10,19.21 15.88,19.68 16.67,22.23 11.91,8.73 13.34,10.32
  pour Top (isolate 0.406, rank 6): 0,0 47,0 47,46 0,46
  pour Bottom (isolate 0.406, rank 6): 0,0 47,0 47,46 0,46
GPIO  (via drill 0.3)
  Top 0.305: v24.61,25.4 24.04,24.83 U4.15 | v34.29,19.37 34.29,16.99 34.7,16.57 R22.1
  Top 0.406: R22.1 R20.1
  Bottom 0.305: v34.29,19.37 34.29,19.43
  Bottom 0.406: 34.29,19.43 33.59,20.13 25.76,20.13 24.61,21.28 v24.61,25.4
N$1  (via drill 0.3)  (3 unrouted)
  Top 0.406: R3.2 v24.53,33.34 | v17.78,34.97 17.1,34.97 16.82,35.25 16.82,35.97
  Bottom 0.406: v17.78,34.97 18.47,35.66 22.2,35.66 v24.53,33.34
N$7  (via drill 0.3)
  Top 0.406: R6.2 R5.1 | R6.2 25.91,38.83 27.3,38.83 R7.1 27.27,38.87 Q2.4 | Q1.4 26.04,43.04 v26.04,43.18 | v26.04,40.32 26.04,39.91 25.65,39.53 R6.2
  Bottom 0.406: v26.04,43.18 v26.04,40.32
N$10
  Top 0.406: R7.2 C6.1
N$13
  Top 0.406: C7.1 R1.2
N$14
  Top 0.406: Q3.4 34.17,32.91 R10.2 34.45,32.64 34.45,30.64 | R9.1 34.45,30.64 | 34.45,30.64 R1.1
N$15
  Top 0.406: C8.1 R11.2
N$16
  Top 0.406: Q4.4 34.17,24.34 R13.2 R12.1 R11.1
N$19
  Top 0.406: SV1.21 35.56,6.35 35.56,8.93 35.57,8.93 35.57,12.02 35.56,12.03 R20.2
N$20
  Top 0.406: R21.2 38.1,6.35 SV1.23
N$21
  Top 0.406: R31.2 20.32,6.35 SV1.9
N$22
  Top 0.406: R30.2 27.94,6.35 SV1.15
N$23
  Top 0.406: R33.2 25.4,6.35 SV1.13
N$24
  Top 0.406: R32.2 22.86,6.35 SV1.11
N$25
  Top 0.406: R34.2 30.48,6.35 SV1.17
N$26
  Top 0.406: R35.2 33.02,6.35 SV1.19
N$27
  Top 0.305: C9.2 U4.22
  Top 0.406: C11.2 C9.2 18.65,31.19 18.41,31.43 16.99,31.43 16.83,31.59 16.83,32.32 L1.1
N$28
  Top 0.305: 28.89,27.72 29.21,27.72 29.53,27.4 Q5.2 | 28.89,27.72 27.15,27.72 R19.1 | Q5.3 28.88,27.7 28.89,27.72
N$29
  Top 0.305: Q5.6 30.18,23 31.11,22.07 R12.2
PDO2  (via drill 0.3)
  Top 0.305: v22.54,28.89 22.54,28.86 20.28,28.86 19.64,28.23 U4.20
  Top 0.406: R9.2 32.61,29.43 v32.54,29.37
  Bottom 0.406: v32.54,29.37 32.07,28.89 v22.54,28.89
PDO3
  Top 0.305: Q5.5 29.53,22.86 28.91,22.24 27.03,22.24 R36.1 26.61,22.23 23.02,22.23 22.38,22.86 22.38,23.97 22.02,24.33 U4.14
RESET
  Top 0.305: R8.1 19.05,12.16 18.41,12.79 18.41,18.89 15.72,21.59 15.72,23.34 16.21,23.83 U4.6
  Top 0.406: R8.1 18.19,11.37 17.84,11.02 SV1.7
SCL
  Top 0.305: R25.1 19.46,16.57 19.03,17 19.03,19.24 17.64,20.63 U4.7
  Top 0.406: R25.1 R31.1
SDA
  Top 0.305: R26.1 22,16.57 21.59,16.99 21.59,19.12 20.57,20.14 18.92,20.14 18.14,20.91 U4.8
  Top 0.406: R26.1 R32.1
VBUS  (via drill 0.3, 0.3 pad 0.6)  (11 unrouted)
  Top 0.305: 5.92,26.65 5.74,26.65 5.4,26.99 | 5.4,26.99 4.92,27.46 v4.6,27.46 | ST1.A4 8.17,26.9 v8.57,27.3 | ST1.B4 5.58,24.15 v4.92,23.5 | v9.68,23.5 9.28,23.9 ST1.A9 8.48,23.9 v8.89,23.5 | v5.4,27.46 5.4,26.99
  Top 0.406: v8.57,27.3 9.02,27.75 D2.1 10.19,27.75 10.32,27.62 11.26,27.62 C4.1 13.22,27.51 v13.34,27.62 | R2.2 18.67,40.73 18.89,40.96 22.07,40.96 22.85,41.74 Q1.5
  Top 0.61: R2.2 R4.1
  Bottom 0.305: v4.6,27.46 v5.4,27.46 8.41,27.46 v8.57,27.3 8.73,27.46 | v4.92,23.5 v9.68,23.5 12.22,23.5 13.34,24.61
  Bottom 0.406: 13.27,33.43 13.49,33.66 v13.49,38.73
  Bottom 0.813: 13.34,24.61 v13.34,27.62 13.34,33.5 13.27,33.43 C13.+
  other vias: 13.49,40.32 14.29,40.32 14.29,39.53 14.29,38.73 13.49,39.53 12.7,39.53 12.7,40.32 12.7,38.73
  pour Bottom (isolate 0.406): 4.92,23.81 11.27,23.81 12.22,24.77 12.22,26.51 11.59,27.15 4.45,27.15 4.13,27.46 4.13,27.94 4.29,28.1 11.59,28.1 12.22,28.73 12.22,40.8 14.61,40.8 14.61,24.92 12.22,22.54 4.92,22.54 4.6,22.86 4.6,23.5
  pour Top (no thermals): 12.06,38.42 14.92,38.42 14.92,39.05 16.35,40.48 23.65,40.48 23.65,43.34 14.92,43.34 12.06,40.48
VBUS_EN_SNK
  Top 0.305: U4.16 23.59,25.33 24.77,26.51 24.77,28.56 26.07,29.87 26.07,32.98 23.97,35.08 23.97,35.94 R5.2
VBUS_VS_DISCH
  Top 0.305: U4.18 21.57,26.33 24.53,29.29 R3.1
VDD
  Top 0.305: C12.2 12.94,29.8 14.57,28.16 17.29,28.16 17.64,27.82 U4.24
  Top 0.406: Q2.2 27.25,41.74 Q1.2 | Q2.1 27.25,42.39 Q1.3 | C12.2 11.84,30.54 11.59,30.8 11.59,32.86 12.86,34.13 18.73,34.13 19.68,35.08 19.68,36.99 20,37.31 22.48,37.31 | R6.1 23.88,39.59 24.77,40.48 24.77,41.06 Q1.1 24.82,41.11 Q2.3
  Top 0.61: R6.1 R4.2 22.48,37.31 C3.2
  pour Top: 24.29,42.7 24.29,40.8 27.78,40.8 27.78,42.7
VREG_1V2
  Top 0.305: C1.2 22.46,29.87 22.07,29.48 20.09,29.48 19.14,28.53 U4.21
VREG_2V7  (via drill 0.3)
  Top 0.305: C2.2 14.84,29.43 15.49,28.78 17.89,28.78 v17.94,28.73 18.14,28.53 U4.23 | 26.83,24.92 v28.1,24.92
  Top 0.406: R19.2 26.83,24.92 R36.2
  Bottom 0.406: v28.1,24.92 27.05,24.92 24.96,27.01 23,27.01 21.27,28.73 v17.94,28.73
VSNK
  Top 0.305: 34.13,41.75 31.75,41.75 | 34.13,41.75 34.89,40.99 D4.1 40.83,40.99 41.59,41.75 VSNK.1 | 31.67,42.47 33.42,42.47 34.13,41.75 | 31.67,41.12 32.31,41.12 | 32.31,41.12 33.5,41.12 34.13,41.75 | 31.59,40.4 32.31,41.12
  Top 0.406: Q2.5 29.22,39.84 30.32,38.73 30.32,36.85 | 30.32,36.85 30.32,36.2 | 30.32,36.2 30.32,35.55 | 30.32,35.55 30.32,33.5 | 30.32,33.5 30.32,32.7 | 30.32,32.7 30.32,31.75 | 30.32,31.75 30.32,29.21 31.9,27.63 | 31.9,27.63 Q4.2 | Q3.2 30.32,36.2 | R10.1 30.32,32.7 | 30.32,33.5 30.23,33.4 C6.2 R14.2 27.72,31.75 30.32,31.75 | Q2.5 29.54,41.12 31.67,41.12 | Q2.5 29.22,40.4 31.59,40.4 | Q2.5 29.22,41.75 31.75,41.75 | Q2.5 29.22,42.47 31.67,42.47 | Q3.1 30.32,36.85 | Q3.3 30.32,35.55 | Q4.1 31.9,28.28 31.9,27.63 | Q4.3 32.7,26.98 | 32.7,26.98 31.9,26.98 31.9,27.63 | R13.1 32.61,26.89 32.7,26.98
  pour Top: 31.27,37.78 31.27,39.69 32.07,40.48 44.77,40.48 45.09,40.8 45.09,42.07 44.29,42.86 28.57,42.86 28.42,42.7 28.42,39.69 29.05,39.05 29.05,29.21 31.43,26.83 34.61,26.83 34.61,28.42 32.54,28.42 31.11,29.84 31.11,34.29 32.23,35.4 34.61,35.4 34.61,36.99 32.07,36.99
VSNK_PDO2
  Top 0.406: C7.2 36.1,35.85 Q3.5 | Q3.5 36.12,36.99 42.07,36.99 | Q3.5 36.12,36.2 41.27,36.2 | Q3.5 36.12,35.56 39.21,35.56 | Q3.5 36.52,35.48 36.52,34.85 38.66,34.85 39.21,35.4 39.21,35.56 | PDO2.1 43.34,36.35 42.7,36.99 42.07,36.99 | 41.27,36.2 42.07,36.99 | 41.27,36.2 40.64,35.56 39.21,35.56
  pour Top: 35.24,37.31 35.24,34.61 41.12,34.61 41.75,33.97 44.61,33.97 45.24,34.61 45.24,36.51 44.45,37.31
VSNK_PDO3
  Top 0.406: C8.2 36.1,27.28 Q4.5 | Q4.5 36.12,28.34 39.29,28.34 | Q4.5 36.12,27.62 38.58,27.62 | Q4.5 36.12,26.99 38.58,26.99 | Q4.5 36.12,26.27 38.42,26.27 38.58,26.43 38.58,26.99 | PDO3.1 43.34,27.62 42.62,28.34 40.01,28.34 | 39.29,28.34 40.01,28.34 | 38.58,27.62 39.29,28.34 | 38.58,26.99 38.58,27.62 | D6.1 40.01,28.34
  pour Top: 35.24,28.73 35.24,26.04 41.12,26.04 41.75,25.4 44.77,25.4 45.24,25.88 45.24,27.94 44.45,28.73
VSYS  (via drill 0.3)
  Top 0.813: L1.2 v16.75,29.53
  Bottom 0.813: v16.75,29.53 16.8,29.48 16.8,24.29 16.8,23.84 13.12,20.16 9.37,20.16 7.3,18.1 7.3,15.08 5.87,13.65 VSYS.2

### Text on the board
tPlace: GND | 3V3 | ABSide | <-12xGND | 3V3 | D- | D+ | RST | SCL | SDA | AL | AT | A0 | A1 | GPIO